# EAGLE design SC card holder v2.1 (EAGLE 7.6.0)
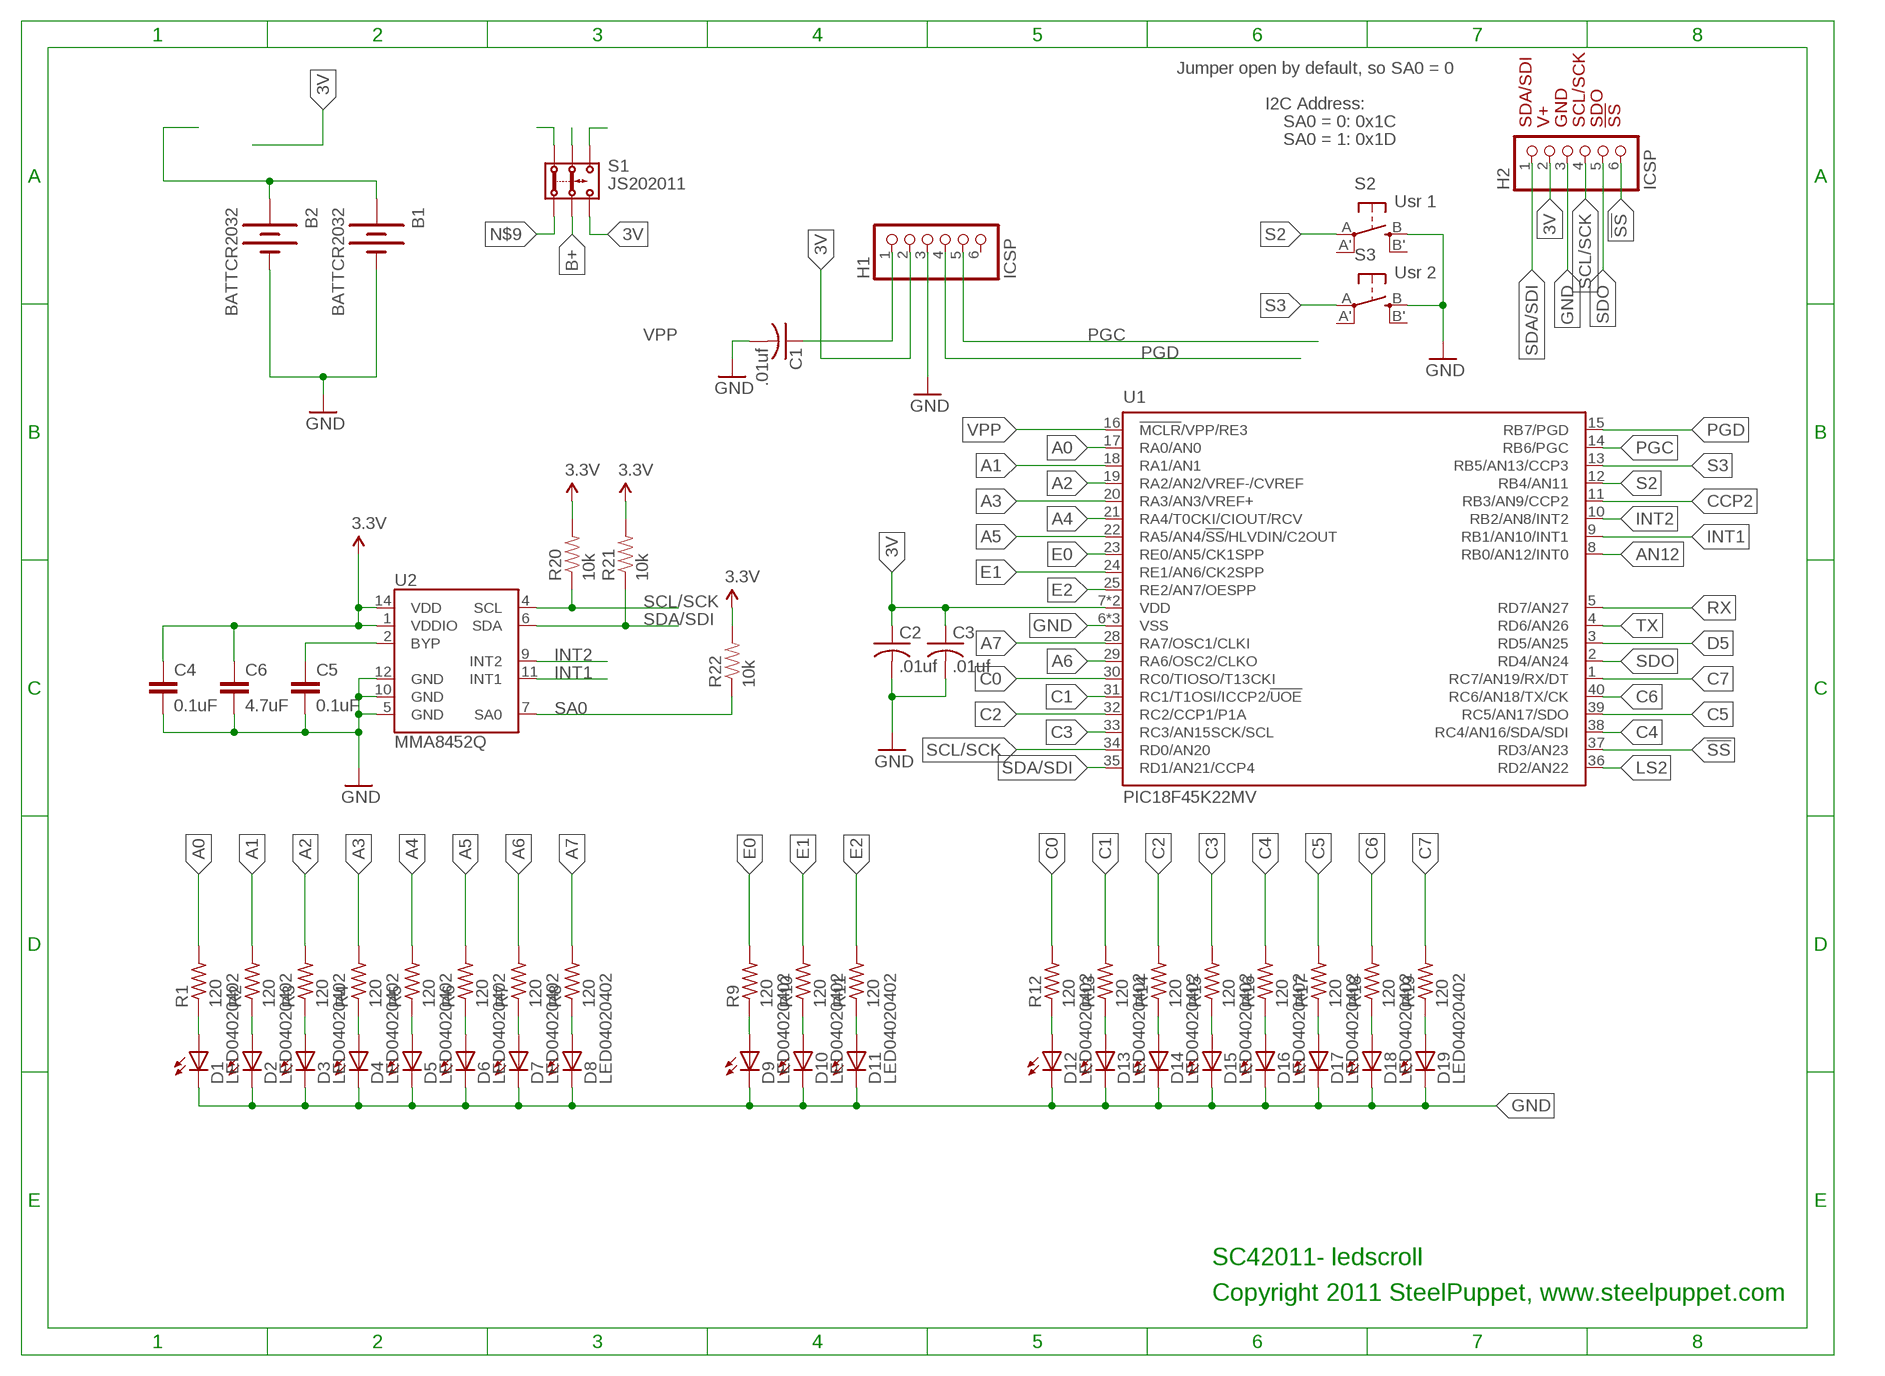
[diagram p0: schematic, sheet 1]

## Parts
B1  BATTCR2032  [BATT_2032_SMT]
B2  BATTCR2032  [BATT_2032_SMT]
C1  .01uf  C-USC0402K  [C0402K]
C2  .01uf  C-USC0402K  [C0402K]
C3  .01uf  C-USC0402K  [C0402K]
C4  0.1uF  CAP0402-CAP  [0402-CAP]
C5  0.1uF  CAP0402-CAP  [0402-CAP]
C6  4.7uF  CAP0402-CAP  [0402-CAP]
D1  LED04020402  [LED0402]
D2  LED04020402  [LED0402]
D3  LED04020402  [LED0402]
D4  LED04020402  [LED0402]
D5  LED04020402  [LED0402]
D6  LED04020402  [LED0402]
D7  LED04020402  [LED0402]
D8  LED04020402  [LED0402]
D9  LED04020402  [LED0402]
D10  LED04020402  [LED0402]
D11  LED04020402  [LED0402]
D12  LED04020402  [LED0402]
D13  LED04020402  [LED0402]
D14  LED04020402  [LED0402]
D15  LED04020402  [LED0402]
D16  LED04020402  [LED0402]
D17  LED04020402  [LED0402]
D18  LED04020402  [LED0402]
D19  LED04020402  [LED0402]
H1  ICSP  PINHD-1X06_2.54-S  [1X06-S]
H2  ICSP  PINHD-1X06_2.54-S  [1X06-S]
R1  120  R-US_R0402  [R0402]
R2  120  R-US_R0402  [R0402]
R3  120  R-US_R0402  [R0402]
R4  120  R-US_R0402  [R0402]
R5  120  R-US_R0402  [R0402]
R6  120  R-US_R0402  [R0402]
R7  120  R-US_R0402  [R0402]
R8  120  R-US_R0402  [R0402]
R9  120  R-US_R0402  [R0402]
R10  120  R-US_R0402  [R0402]
R11  120  R-US_R0402  [R0402]
R12  120  R-US_R0402  [R0402]
R13  120  R-US_R0402  [R0402]
R14  120  R-US_R0402  [R0402]
R15  120  R-US_R0402  [R0402]
R16  120  R-US_R0402  [R0402]
R17  120  R-US_R0402  [R0402]
R18  120  R-US_R0402  [R0402]
R19  120  R-US_R0402  [R0402]
R20  10k  RESISTOR0402-RES  [0402-RES]
R21  10k  RESISTOR0402-RES  [0402-RES]
R22  10k  RESISTOR0402-RES  [0402-RES]
S1  JS202011  [JS202011SMT]
S2  Usr 1  SPST_TACT-EVQQ2  [EVQ-Q2]
S3  Usr 2  SPST_TACT-EVQQ2  [EVQ-Q2]
U1  PIC18F45K22MV  [QFN40-5X5]
U2  MMA8452Q  [QFN-16_0.5MM]

## Nets
3V: C2.1 C3.1 C4.1 C6.1 H1.2 H2.2 R20.2 R21.2 R22.2 S1.3(3.2) S1.4(3.1) U1.7(VDD) U1.26(VDD) U2.1(VDDIO) U2.14(VDD) ; supply symbol labelled 3.3V
!SS: H2.6 U1.37(RD3/AN23)
A0: R1.2 U1.17(RA0/AN0)
A1: R2.2 U1.18(RA1/AN1)
A2: R3.2 U1.19(RA2/AN2/VREF-/CVREF)
A3: R4.2 U1.20(RA3/AN3/VREF+)
A4: R5.2 U1.21(RA4/T0CKI/CIOUT/RCV)
A5: R6.2 U1.22(RA5/AN4/!SS!/HLVDIN/C2OUT)
A6: R7.2 U1.29(RA6/OSC2/CLKO)
A7: R8.2 U1.28(RA7/OSC1/CLKI)
AN12: U1.8(RB0/AN12/INT0)
B+: B1.1(+) B1.3(+) B2.1(+) B2.3(+) S1.2(2.2) S1.5(2.1)
BYP: C5.1 U2.2(BYP)
C0: R12.2 U1.30(RC0/TIOSO/T13CKI)
C1: R13.2 U1.31(RC1/T1OSI/ICCP2/!UOE)
C2: R14.2 U1.32(RC2/CCP1/P1A)
C3: R15.2 U1.33(RC3/AN15SCK/SCL)
C4: R16.2 U1.38(RC4/AN16/SDA/SDI)
C5: R17.2 U1.39(RC5/AN17/SDO)
C6: R18.2 U1.40(RC6/AN18/TX/CK)
C7: R19.2 U1.1(RC7/AN19/RX/DT)
CCP2: U1.11(RB3/AN9/CCP2)
D5: U1.3(RD5/AN25)
E0: R9.2 U1.23(RE0/AN5/CK1SPP)
E1: R10.2 U1.24(RE1/AN6/CK2SPP)
E2: R11.2 U1.25(RE2/AN7/OESPP)
GND: B1.2(-) B2.2(-) C1.2 C2.2 C3.2 C4.2 C5.2 C6.2 D1.C D2.C D3.C D4.C D5.C D6.C D7.C D8.C D9.C D10.C D11.C D12.C D13.C D14.C D15.C D16.C D17.C D18.C D19.C H1.3 H2.3 S2.B(S) S3.B(S) U1.6(VSS) U1.27(VSS) U1.41(VSS) U2.5(GND) U2.10(GND) U2.12(GND)
INT1: U1.9(RB1/AN10/INT1) U2.11(INT1)
INT2: U1.10(RB2/AN8/INT2) U2.9(INT2)
LS2: U1.36(RD2/AN22)
N$2: D1.A R1.1
N$3: D2.A R2.1
N$4: D3.A R3.1
N$5: D4.A R4.1
N$6: D9.A R9.1
N$7: D10.A R10.1
N$8: D11.A R11.1
N$9: S1.1(1.2)
N$11: D13.A R13.1
N$12: D14.A R14.1
N$13: D15.A R15.1
N$14: D12.A R12.1
N$15: S1.6(1.1)
N$18: D6.A R6.1
N$20: D7.A R7.1
N$21: D16.A R16.1
N$22: D17.A R17.1
N$23: D8.A R8.1
N$24: D5.A R5.1
N$25: D18.A R18.1
N$26: D19.A R19.1
PGC: H1.5 U1.14(RB6/PGC)
PGD: H1.4 U1.15(RB7/PGD)
RX: U1.5(RD7/AN27)
S2: S2.A(P) U1.12(RB4/AN11)
S3: S3.A(P) U1.13(RB5/AN13/CCP3)
SA0: R22.1 U2.7(SA0)
SCL/SCK: H2.4 R20.1 U1.34(RD0/AN20) U2.4(SCL)
SDA/SDI: H2.1 R21.1 U1.35(RD1/AN21/CCP4) U2.6(SDA)
SDO: H2.5 U1.2(RD4/AN24)
TX: U1.4(RD6/AN26)
VPP: C1.1 H1.1 U1.16(!MCLR!/VPP/RE3)
Unconnected: H1.6 S2.A'(P1) S2.B'(S1) S3.A'(P1) S3.B'(S1)

## Notes on the sheet
- Jumper open by default, so SA0 = 0
- I2C Address:
- SA0 = 0: 0x1C | SDA/SDI | V+ | GND | SCL/SCK | SDO | !SS
- SA0 = 1: 0x1D
- SC42011- ledscroll
- Copyright 2011 SteelPuppet, www.steelpuppet.com

## Library data of the parts
B1 B2 = dfb-parts:BATTCR2032
C1-C3 = rcl:C-US: CAPACITOR, American symbol
C4-C6 = SparkFun:CAP: Capacitor Standard 0603 ceramic capacitor, and 0.1" leaded capacitor.
D1-D19 = dfb-parts:LED0402
H1 H2 = pinhead-2:PINHD-1X06: PIN HEADER
R1-R19 = rcl:R-US_: RESISTOR, American symbol
R20-R22 = SparkFun:RESISTOR: Resistor Basic schematic elements and footprints for 0603, 1206, and PTH resistors.
S1 = dfb-parts:JS202011
S2 S3 = adafruit:SPST_TACT: SMT 6mm switch, EVQQ2 series http://www.ladyada.net/library/eagle
U1 = dfb-parts:PIC18F45K22
U2 = SparkFun:MMA8452Q: MMA8452Q 3-Axis, 12/8-bit Digital Accelerometer Supply Voltage: 1.6-3.6V Range: +/- 2g, 4g, 8g Interface: I2C, 12-bit and 8-bit ODR: 1.56 Hz - 800 Hz Package: QFN-16 http://cache.freescale.com/files/sensors/doc/data_sheet/MMA8452Q.pdf

## Board
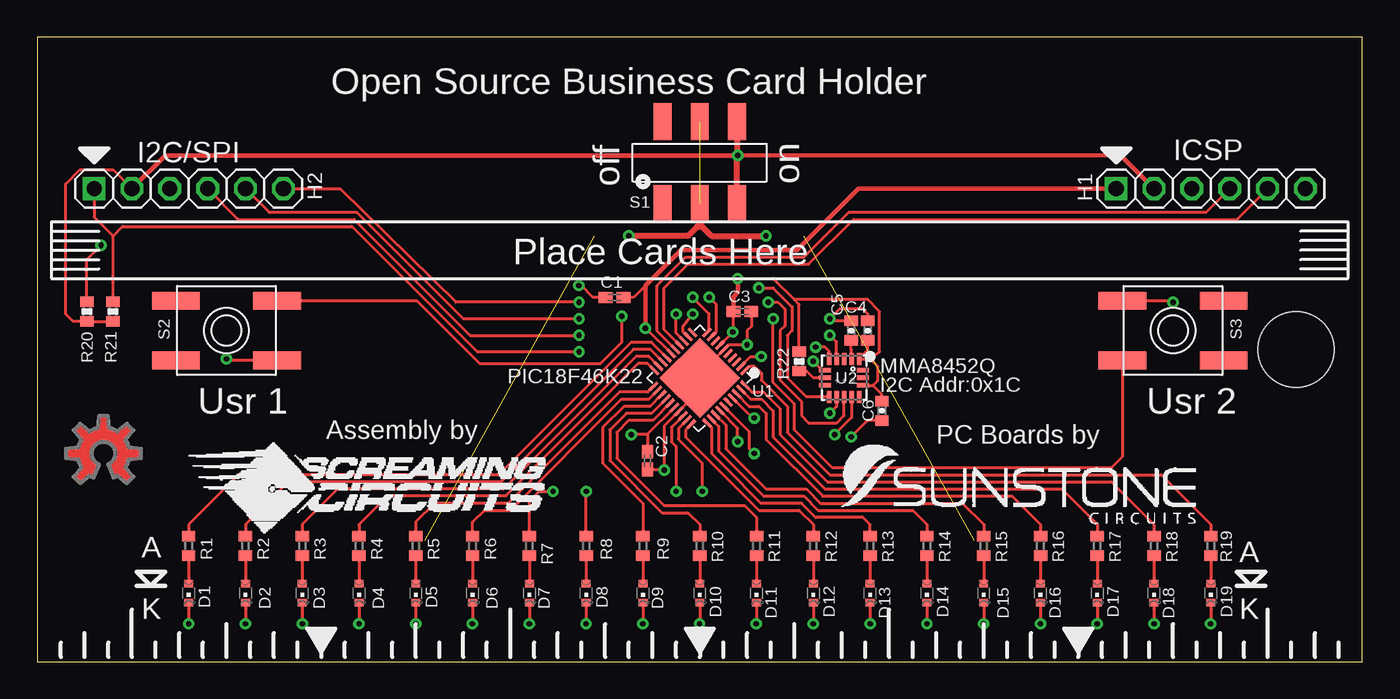
[diagram p1: board, top side]
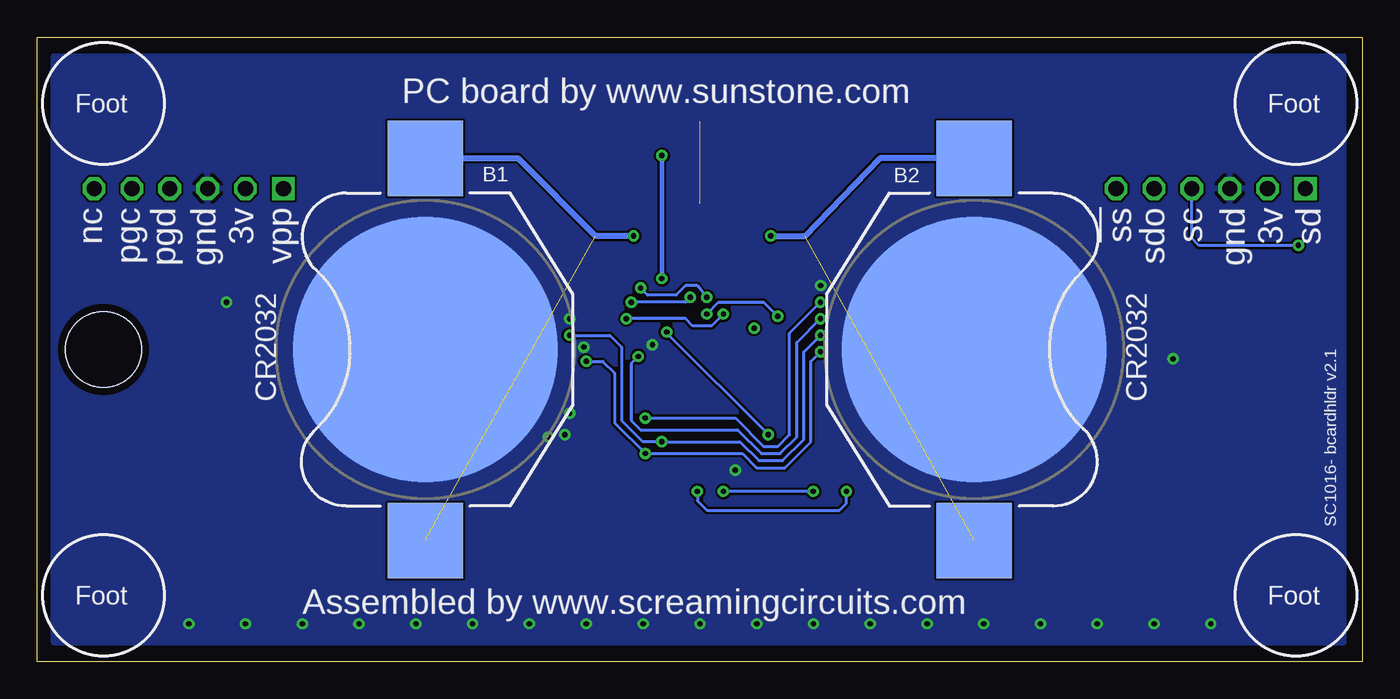
[diagram p2: board, bottom side, seen from below]

Size 88.9 x 41.91 mm. Coordinates in mm from the lower left corner, seen from the top.
Outline: 0,41.91 0,0 88.9,0 88.9,41.91 0,41.91
Copper layers (1*16): Top 0.0178mm / dielectric 59mil / Bottom 0.0178mm
Design rules "SSC-EAGLE-2Lyr_v1.0.0.3 *": minimum track width 6mil, minimum drill 14mil, track to track 6mil, track to pad 6mil, pad to pad 6mil, via to via 6mil, smd to smd 6mil, copper to edge 20mil, drill to drill 16mil, minimum pad ring 8mil, minimum via ring 8mil, stop-mask expansion 3mil, vias tented up to drill 15mil, thermal gap 10mil
Holes 5.08 mm at 84.45,20.95

### Footprints (pad centres in the part's own frame; a part is rotated, then mirrored left to right if it is on the bottom)
BATT_2032_SMT = smd 5.08 x 5.08: 1 -12.827,0; 3 12.827,0 | smd 17.78 x 17.78: 2 0,0
C0402K = smd 0.925 x 0.74: 1 -0.6,0; 2 0.6,0
0402-CAP = smd 0.7 x 0.9: 1 -0.65,0; 2 0.65,0
LED0402 = smd 0.5 x 0.6: A 0.65,0; C -0.65,0
1X06-S = drill 1.016 square: 1 -6.35,0 | drill 1.016 octagon: 2 -3.81,0; 3 -1.27,0; 4 1.27,0; 5 3.81,0; 6 6.35,0
R0402 = smd 0.7 x 0.9: 1 -0.65,0; 2 0.65,0
0402-RES = smd 0.7 x 0.9: 1 -0.65,0; 2 0.65,0
JS202011SMT = smd 2.502 x 1.194: 1 -2.75,2.489; 2 -2.75,0; 3 -2.75,-2.489; 4 2.75,-2.489; 5 2.75,0; 6 2.75,2.489
EVQ-Q2 = smd 3.2 x 1.2: A -3.4,-2; A' 3.4,-2; B -3.4,2; B' 3.4,2
QFN40-5X5 = smd 0.75 x 0.2: 1 -2.5,1.8; 2 -2.5,1.4; 3 -2.5,1; 4 -2.5,0.6; 5 -2.5,0.2; 6 -2.5,-0.2; 7 -2.5,-0.6; 8 -2.5,-1; 9 -2.5,-1.4; 10 -2.5,-1.8; 21 2.6,-1.8; 22 2.6,-1.4; 23 2.6,-1; 24 2.6,-0.6; 25 2.6,-0.2; 26 2.6,0.2; 27 2.6,0.6; 28 2.6,1; 29 2.6,1.4; 30 2.6,1.8 | smd 0.2 x 0.75: 11 -1.8,-2.5; 12 -1.4,-2.5; 13 -1,-2.5; 14 -0.6,-2.5; 15 -0.2,-2.5; 16 0.2,-2.5; 17 0.6,-2.5; 18 1,-2.5; 19 1.4,-2.5; 20 1.8,-2.5; 31 1.8,2.5; 32 1.4,2.5; 33 1,2.5; 34 0.6,2.5; 35 0.2,2.5; 36 -0.2,2.5; 37 -0.6,2.5; 38 -1,2.5; 39 -1.4,2.5; 40 -1.8,2.5 | smd 3.8 x 3.8: 41 0,0
QFN-16_0.5MM = smd 0.8 x 0.3: 1 -1.275,1; 2 -1.275,0.5; 3 -1.275,0; 4 -1.275,-0.5; 5 -1.275,-1; 9 1.275,-1; 10 1.275,-0.5; 11 1.275,0; 12 1.275,0.5; 13 1.275,1 | smd 0.3 x 0.8: 6 -0.5,-1.275; 7 0,-1.275; 8 0.5,-1.275; 14 0.5,1.275; 15 0,1.275; 16 -0.5,1.275

### Placement (x,y rotation side)
B1  62.87,20.95 90 bottom
B2  26.04,20.95 270 bottom
C1  38.73,24.45 180 top
C2  40.96,13.49 270 top
C3  47.31,23.5 0 top
C4  55.72,22.23 90 top
C5  54.61,22.23 90 top
C6  56.67,16.83 270 top
D1  10.16,4.6 90 top
D2  13.97,4.6 90 top
D3  17.78,4.6 90 top
D4  21.59,4.6 90 top
D5  25.4,4.6 90 top
D6  29.21,4.6 90 top
D7  33.02,4.6 90 top
D8  36.83,4.6 90 top
D9  40.64,4.6 90 top
D10  44.45,4.6 90 top
D11  48.26,4.6 90 top
D12  52.07,4.6 90 top
D13  55.88,4.6 90 top
D14  59.69,4.6 90 top
D15  63.5,4.6 90 top
D16  67.31,4.6 90 top
D17  71.12,4.6 90 top
D18  74.93,4.6 90 top
D19  78.74,4.6 90 top
H1  78.74,31.75 0 top
H2  10.16,31.75 0 top
R1  10.16,7.78 90 top
R2  13.97,7.78 90 top
R3  17.78,7.78 90 top
R4  21.59,7.78 90 top
R5  25.4,7.78 90 top
R6  29.21,7.78 90 top
R7  33.02,7.78 90 top
R8  36.83,7.78 90 top
R9  40.64,7.78 90 top
R10  44.45,7.78 90 top
R11  48.26,7.78 90 top
R12  52.07,7.78 90 top
R13  55.88,7.78 90 top
R14  59.69,7.78 90 top
R15  63.5,7.78 90 top
R16  67.31,7.78 90 top
R17  71.12,7.78 90 top
R18  74.93,7.78 90 top
R19  78.74,7.78 90 top
R20  3.33,23.5 270 top
R21  5.08,23.5 270 top
R22  51.12,20.16 90 top
S1  44.45,33.5 90 top
S2  12.7,22.23 180 top
S3  76.2,22.23 0 top
U1  44.45,19.05 225 top
U2  54.13,19.05 270 top
U$1  [SUNSTONE-LOGO]  65.72,11.43 0 top
U$2  [OSHWLOGO_TOP_0.2]  4.45,13.97 0 top
U$3  [SC-LOGO]  23.5,11.11 0 top

### Tracks (layer width: path | path; a pad name or v marks a point on that pad's centre or on a via)
3V  (via drill 0.36)
  Top 0.203: C2.1 40.96,15.28 U1.26 40.92,15.24 v39.85,15.24 | U1.7 v46.67,22.12 46.67,23.34 C3.1 | v46.99,25.72 49.37,25.72 50.8,24.29 | R21.2 R20.2 2.4,22.84 1.91,23.34 1.91,32.07 2.86,33.02 5.08,33.02 H2.2 | U2.14 56.06,18.55 | C6.1 56.67,17.94 56.06,18.55 | 55.88,20.32 U2.1 55.13,20.37 55.72,20.95 C4.1 | 55.88,20.32 56.36,19.84 56.36,18.84 56.06,18.55 | 55.88,20.32 56.52,20.8 56.52,23.5 55.72,24.29 50.8,24.29 | R22.2 51.12,23.97 50.8,24.29
  Top 0.254: 72.71,33.97 v46.99,33.97
  Top 0.305: H1.2 72.71,33.97 | H2.2 8.57,33.97 v46.99,33.97 | C3.1 46.71,24.48 46.99,24.77 47.02,24.96 v46.99,25.72
  Top 0.406: S1.3 46.94,33.76 v46.99,33.97 46.99,33.81 46.94,34.02 S1.4
  Bottom 0.203: v46.67,22.12 46.67,22.07 v39.85,15.24
  Bottom 0.305: v46.99,25.72 v46.99,33.97
!SS  (via drill 0.36)
  Top 0.203: U1.37 48,16.35 v48.1,16.35 | H2.6 20.32,31.75 28.1,24.13 v36.35,24.13
  Bottom 0.203: v48.1,16.35 42.07,16.35 40.16,14.45 39.21,14.45 38.42,15.24 38.42,22.07 v36.35,24.13
A0
  Top 0.203: U1.17 41.22,21.43 39.85,21.43 30.96,12.54 13.49,12.54 10.16,9.21 R1.2
A1
  Top 0.203: U1.18 41.13,20.95 40.01,20.95 31.11,12.06 16.83,12.06 13.97,9.21 R2.2
A2
  Top 0.203: U1.19 41.04,20.48 40.16,20.48 31.27,11.59 20.16,11.59 17.78,9.21 R3.2
A3
  Top 0.203: U1.20 40.95,20 40.32,20 31.43,11.11 23.5,11.11 21.59,9.21 R4.2
A4
  Top 0.203: U1.21 40.95,18.1 39.05,18.1 31.59,10.64 26.67,10.64 25.4,9.37 R5.2
A5
  Top 0.203: U1.22 41.04,17.62 39.21,17.62 31.75,10.16 30,10.16 29.21,9.37 R6.2
A6  (via drill 0.36)
  Top 0.203: U1.29 43.02,15.64 43.02,14.92 44.61,13.34 v44.61,11.43 | R7.2 33.02,10.79 33.66,11.43 v34.61,11.43
  Bottom 0.203: v44.61,11.43 44.61,10.79 43.97,10.16 35.08,10.16 34.61,10.64 v34.61,11.43
A7  (via drill 0.36)
  Top 0.203: U1.28 42.55,15.73 42.55,14.76 42.86,14.45 v42.86,11.43 | R8.2 v36.83,11.43
  Bottom 0.203: v36.83,11.43 v42.86,11.43
B+  (via drill 0.36)  (3 unrouted)
  Top 0.406: S1.2 44.45,29.37 44.29,29.21 | 44.29,29.21 43.66,28.57 v39.69,28.57 | 44.29,29.21 44.61,29.21 45.24,28.57 v48.9,28.57
  Bottom 0.406: 25.37,33.81 B2.1 32.35,33.78 37.4,28.57 v39.69,28.57 | v48.9,28.57 51.44,28.57 56.64,33.78 B1.3
BYP
  Top 0.203: U2.2 54.63,20.93 54.61,20.95 C5.1
C0
  Top 0.203: U1.30 43.5,15.55 43.5,15.08 48.42,10.16 51.12,10.16 52.07,9.21 R12.2
C1
  Top 0.203: R13.2 55.88,9.21 55.4,9.68 52.23,9.68 51.28,10.64 48.57,10.64 46.19,13.02 45.24,13.97 45.24,15.71 U1.31
C2
  Top 0.203: R14.2 59.69,9.21 58.74,10.16 52.39,10.16 51.44,11.11 48.74,11.11 45.72,14.13 45.72,15.8 U1.32
C3
  Top 0.203: U1.33 45.51,16.56 46.2,15.88 46.2,14.29 48.9,11.59 51.59,11.59 52.55,10.64 62.07,10.64 63.5,9.21 R15.2
C4
  Top 0.203: U1.38 47.77,17.14 48.42,17.14 48.9,16.67 48.9,14.92 52.7,11.11 65.41,11.11 67.31,9.21 R16.2
C5
  Top 0.203: U1.39 47.86,17.62 48.58,17.62 49.37,16.83 49.37,15.08 52.86,11.59 68.74,11.59 71.12,9.21 R17.2
C6
  Top 0.203: U1.40 47.95,18.1 48.74,18.1 49.85,16.99 49.85,15.24 53.02,12.06 72.07,12.06 74.93,9.21 R18.2
C7
  Top 0.203: U1.1 47.79,19.84 48.1,19.84 48.58,19.37 48.58,18.89 50.32,17.14 50.32,15.4 53.18,12.54 75.41,12.54 78.74,9.21 R19.2
E0
  Top 0.203: U1.23 41.12,17.14 39.37,17.14 37.94,15.72 37.94,13.34 40.64,10.64 R9.2
E1
  Top 0.203: R10.2 44.45,9.21 43.66,10 41.91,10 38.42,13.49 38.42,15.56 39.53,16.67 41.22,16.67 U1.24
E2
  Top 0.203: R11.2 48.26,9.68 47.47,10.48 42.07,10.48 38.89,13.65 38.89,15.4 39.69,16.19 41.31,16.19 U1.25
GND  (via drill 0.36)
  Top 0.203: C2.2 40.99,12.86 v42.07,12.86 42.07,15.82 U1.27 44.45,18.2 U1.41 44.45,19.33 U1.6 46.39,21.27 v47.62,21.27 47.62,22.23 47.91,22.51 C3.2 | C1.2 37.31,24.45 36.51,25.24 v36.34,25.24 | D19.C 78.74,2.55 v78.73,2.54 | D18.C v74.93,2.54 | D17.C v71.12,2.54 | D16.C v67.31,2.54 | D15.C v63.5,2.54 v63.49,2.54 | D14.C v59.69,2.54 | D13.C v55.88,2.54 | D12.C 52.07,2.55 v52.06,2.54 | D11.C 48.26,2.55 v48.25,2.54 | D10.C 44.45,2.55 v44.44,2.54 | D9.C 40.64,2.55 v40.63,2.54 | D8.C 36.83,2.55 v36.82,2.54 | D7.C 33.02,2.55 v33.01,2.54 | D6.C 29.21,2.55 v29.2,2.54 | D5.C v25.4,2.54 | D4.C v21.59,2.54 | D3.C v17.78,2.54 | D2.C v13.97,2.54 | D1.C v10.16,2.54 | U2.10 53.63,17.12 v53.18,16.67 | U2.12 54.63,16.38 v53.5,15.24 | U2.5 53.13,20.84 52.86,21.11 v52.23,21.11 | C5.2 53.33,22.88 v53.18,23.02 53.82,23.65 55.4,23.65 55.72,23.34 C4.2 | C6.2 55.71,16.18 v54.61,15.08 | S3.B 76.11,24.23 v76.2,24.13 | S2.B 12.79,20.23 v12.7,20.32
  pour Bottom: 87.79,40.64 1.27,40.64 1.27,1.27 87.79,1.27
INT1  (via drill 0.36)
  Top 0.203: U1.9 45.56,22.14 45.56,23.97 v45.09,24.45 | v49.05,24.13 49.69,24.13 50.16,23.65 50.16,22.54 49.85,22.23 49.85,18.89 51.28,17.46 51.28,16.51 51.75,16.03 53.66,16.03 54.13,16.51 U2.11
  Bottom 0.203: v45.09,24.45 45.4,24.13 v49.05,24.13
INT2  (via drill 0.36)
  Top 0.203: U1.10 45.09,22.23 45.09,23.34 v43.97,24.45 | v48.42,25.08 49.37,25.08 50.64,23.81 50.64,22.23 50.32,21.91 50.32,19.05 51.6,17.77 U2.9
  Bottom 0.203: v43.97,24.45 44.61,25.24 45.4,25.24 46.04,24.61 47.94,24.61 v48.42,25.08
N$2
  Top 0.203: R1.1 D1.A
N$3
  Top 0.203: R2.1 D2.A
N$4
  Top 0.203: R3.1 D3.A
N$5
  Top 0.203: R4.1 D4.A
N$6
  Top 0.203: R9.1 D9.A
N$7
  Top 0.203: R10.1 D10.A
N$8
  Top 0.203: R11.1 D11.A
N$11
  Top 0.203: R13.1 D13.A
N$12
  Top 0.203: R14.1 D14.A
N$13
  Top 0.203: R15.1 D15.A
N$14
  Top 0.203: R12.1 D12.A
N$18
  Top 0.203: R6.1 D6.A
N$20
  Top 0.203: R7.1 D7.A
N$21
  Top 0.203: R16.1 D16.A
N$22
  Top 0.203: R17.1 D17.A
N$23
  Top 0.203: R8.1 D8.A
N$24
  Top 0.203: R5.1 D5.A
N$25
  Top 0.203: R18.1 D18.A
N$26
  Top 0.203: R19.1 D19.A
PGC
  Top 0.203: U1.14 42.07,22.28 42.07,25.08 43.66,26.67 51.75,26.67 54.77,29.69 80.49,29.69 H1.5
PGD
  Top 0.203: U1.15 41.59,22.19 41.59,25.24 43.5,27.15 51.44,27.15 54.45,30.16 78.42,30.16 H1.4
S2  (via drill 0.36)
  Top 0.203: U1.12 43.34,22.14 43.34,22.54 v43.97,23.34 | v39.21,23.18 39.21,21.43 37.78,20 29.69,20 25.46,24.23 S2.A
  Bottom 0.203: v43.97,23.34 43.18,24.13 40.16,24.13 v39.21,23.18
S3  (via drill 0.36)
  Top 0.203: v49.37,23.02 49.37,18.73 50.8,17.3 50.8,15.56 53.34,13.02 72.07,13.02 72.8,13.74 S3.A | U1.13 42.86,22.05 v42.86,23.34
  Bottom 0.203: v42.86,23.34 43.66,22.54 44.93,22.54 45.4,23.02 v49.37,23.02
SA0
  Top 0.203: U2.7 52.09,19.05 51.59,19.51 R22.1
SCL/SCK  (via drill 0.36)
  Top 0.203: U1.34 46.99,15.66 v46.99,14.76 | H2.4 13.49,29.69 21.27,29.69 29.05,21.91 v36.35,21.91 | R20.1 3.33,26.99 v4.29,27.94 | U2.4 53.63,21.45 v53.18,21.91
  Bottom 0.203: v36.35,21.91 37.47,20.8 37.47,14.92 38.89,13.49 40.48,13.49 41.75,14.76 v46.99,14.76 48.26,14.76 49.69,16.19 49.69,21.11 50.48,21.91 v53.18,21.91 | v4.29,27.94 10.95,27.94 11.43,28.42 H2.4
SDA/SDI  (via drill 0.36)
  Top 0.203: U1.35 47.78,15.43 47.78,14.29 v48.1,13.97 | H2.1 3.81,29.84 5.08,28.57 | 5.08,28.57 5.71,29.21 21.11,29.21 29.53,20.8 v36.35,20.8 | R21.1 5.08,28.57 | U2.6 52.68,19.55 v52.07,20.16
  Bottom 0.203: v36.35,20.8 36.99,20.16 36.99,14.76 38.73,13.02 40.64,13.02 41.59,13.97 v48.1,13.97 50.16,16.03 50.16,19.37 50.96,20.16 v52.07,20.16
SDO  (via drill 0.36)
  Top 0.203: U1.2 47.86,20.48 v48.58,20.48 | H2.5 15.56,30.16 21.43,30.16 28.57,23.02 v36.35,23.02
  Bottom 0.203: v48.58,20.48 49.05,20 49.05,16.19 48.42,15.56 41.91,15.56 40.32,13.97 39.05,13.97 37.94,15.08 37.94,21.43 v36.35,23.02
VPP  (via drill 0.36)
  Top 0.203: U1.16 40.99,22.23 v40.8,22.38 | 40.8,25.24 40.01,24.45 C1.1
  Top 0.305: H1.1 55.09,31.75 50.96,27.62 43.18,27.62 40.8,25.24 v40.8,22.38

### Text on the board
tPlace: Open Source Business Card Holder | ICSP | I2C/SPI | off | on | Place Cards Here | PIC18F46K22 | MMA8452Q | Usr 1 | I2C Addr:0x1C | Usr 2 | Assembly by | PC Boards by | A | A | K | K
bPlace: Foot | PC board by www.sunstone.com | Foot | sd | 3v | gnd | sc | sdo | !ss | vpp | 3v | gnd | pgd | pgc | nc | CR2032 | CR2032 | SC1016- bcardhldr v2.1 | Foot | Foot | Assembled by www.screamingcircuits.com
tNames: U1
tDocu: Red | Grn | Red | Grn | Red | Grn | Red | Grn | Red | Grn | Red | Grn | Red | Grn | Red | Grn | Red | Grn | Red